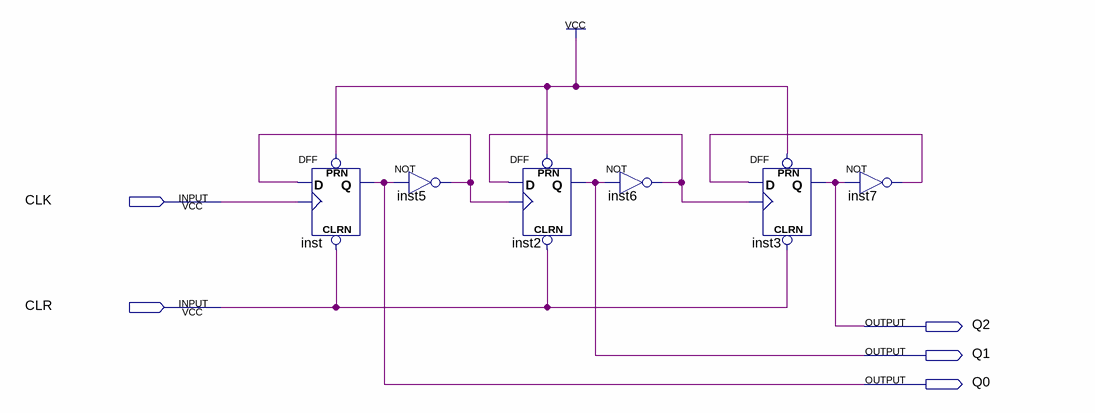
[diagram p0: schematic sheet]
// Quartus schematic ripple_counter_8.bdf as structural Verilog: 6 symbols, 5 pins
module ripple_counter_8 (
  input  CLK,
  input  CLR,
  output Q2,
  output Q1,
  output Q0
);

  wire inst5_out, inst6_out, inst7_out;

  DFF inst (.CLRN(CLR), .CLK(CLK), .D(inst5_out), .PRN(1'b1), .Q(Q0));
  not inst5 (inst5_out, Q0);
  DFF inst2 (.CLRN(CLR), .CLK(inst5_out), .D(inst6_out), .PRN(1'b1), .Q(Q1));
  not inst6 (inst6_out, Q1);
  DFF inst3 (.CLRN(CLR), .CLK(inst6_out), .D(inst7_out), .PRN(1'b1), .Q(Q2));
  not inst7 (inst7_out, Q2);
endmodule
